# Altium schematic sheet PWR_78XX79XX.SchDoc
size A3
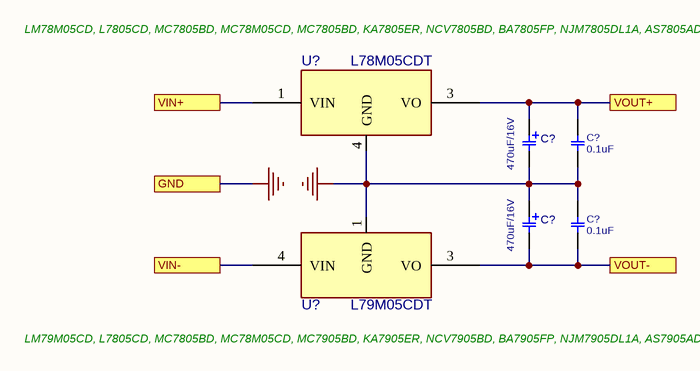
[diagram p0: PWR_78XX79XX.SchDoc]

## Parts
(Parts that share a designator on the sheet are numbered #1, #2 ... from top to bottom, then left to right.)
C?#1  470uF/16V  [C_EL_8X12]
C?#2  0.1uF  [C0603]
C?#3  470uF/16V  [C_EL_8X12]
C?#4  0.1uF  [C0603]
U?#1  L78M05CDT  [DPAK_3]
U?#2  L79M05CDT  [DPAK_3]

## Ports
GND, VIN+, VIN-, VOUT+, VOUT-

## Nets
GND: C?#1.2 C?#2.1 C?#3.1 C?#4.2 U?#1.4(GND) U?#2.1(GND) ; port GND
VIN+: U?#1.1(VIN) ; port VIN+
VIN-: U?#2.4(VIN) ; port VIN-
VOUT+: C?#1.1 C?#2.2 U?#1.3(VO) ; port VOUT+
VOUT-: C?#3.2 C?#4.1 U?#2.3(VO) ; port VOUT-

## Notes on the sheet
- LM78M05CD, L7805CD, MC7805BD, MC78M05CD, MC7805BD, KA7805ER, NCV7805BD, BA7805FP, NJM7805DL1A, AS7805AD
- LM79M05CD, L7805CD, MC7805BD, MC78M05CD, MC7905BD, KA7905ER, NCV7905BD, BA7905FP, NJM7905DL1A, AS7905AD

## Library data of the parts
C?#1 C?#3 = CAP_THD_EL_8X12: CAP, THD, ELEC,; MANF_P#: MANF_PART#; PARAM2: 25V; DESC: DESCRIPTION; DIST#: MOUSER; PARAM: 20%; PRICE: 10= 5$; MANF: MANF; ASSEMBLY: ASSEMBLY; VALUE: 470uF/16V
C?#2 C?#4 = CAP_SMD_MLCC_0805: CAP, MLCC, -F, -V, MATERIAL, -%, 0201; PARAM: -, -%; MANF_P#: MANF_PART#; PRICE: 100= 1$; MANF: -; PARAM2: -V; ASSEMBLY: ASSEMBLY; VALUE: 0.1uF
U?#1 = VREG_78M05_TO252: REG, Linear, Fixed, 5v, 0.5A, TO-252; MANF_P#: LM78M05CDT, L7805CDT, MC7805BDT, MC78M05CDT, MC7805BDT, KA7805ERT, NCV7805BDT, BA7805FP, NJM7805DL1A, AS7805ADTR; MANF: TI, ST, FAIRCHILD, ON, NJR, ROHM, DIODES; PARAM: 5v, 0.5A; PARAM2: PARAM2; VALUE: L78M05CDT
U?#2 = VREG_79M05_TO252: REG, Linear, Fixed, 5v, 0.5A, TO-252; MANF_P#: LM79M05CDT, L7805CDT, MC7805BDT, MC78M05CDT, MC7905BDT, KA7905ERT, NCV7905BDT, BA7905FP, NJM7905DL1A, AS7905ADTR; MANF: TI, ST, FAIRCHILD, ON, NJR, ROHM, DIODES; PARAM: 5v, 0.5A; PARAM2: PARAM2; VALUE: L79M05CDT